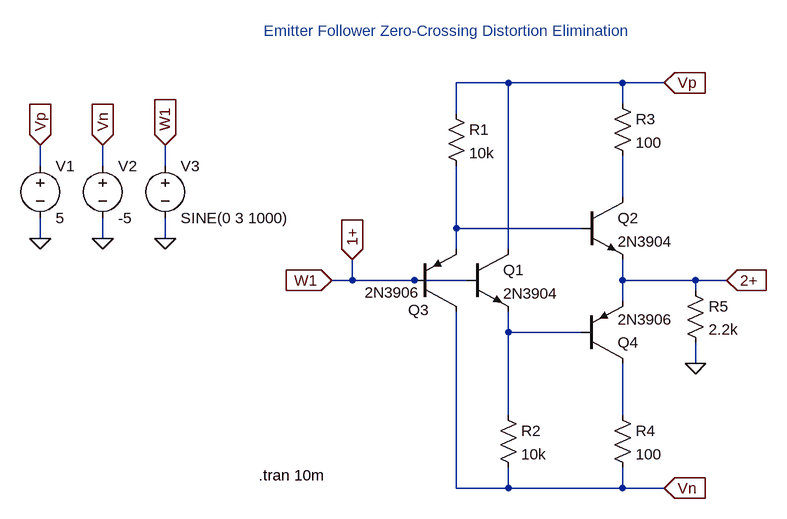
[diagram p0: schematic emit_ff_zero_crossing_elim_ltspice.asc]
emit_ff_zero_crossing_elim_ltspice.asc, the LTspice schematic file:
Version 4
SHEET 1 880 680
WIRE 128 -192 48 -192
WIRE 304 -192 128 -192
WIRE 368 -192 304 -192
WIRE 304 -160 304 -192
WIRE 48 -144 48 -192
WIRE -592 -64 -592 -96
WIRE -496 -64 -496 -96
WIRE -400 -64 -400 -96
WIRE 304 -16 304 -80
WIRE 48 32 48 -64
WIRE 240 32 48 32
WIRE -592 48 -592 16
WIRE -496 48 -496 16
WIRE -400 48 -400 16
WIRE 48 64 48 32
WIRE 128 64 128 -192
WIRE -112 112 -112 80
WIRE -112 112 -144 112
WIRE -16 112 -112 112
WIRE 64 112 -16 112
WIRE 304 112 304 80
WIRE 416 112 304 112
WIRE 464 112 416 112
WIRE 416 128 416 112
WIRE 304 144 304 112
WIRE 128 192 128 160
WIRE 240 192 128 192
WIRE 416 240 416 208
WIRE 128 320 128 192
WIRE 304 320 304 240
WIRE 48 432 48 160
WIRE 128 432 128 400
WIRE 128 432 48 432
WIRE 304 432 304 400
WIRE 304 432 128 432
WIRE 368 432 304 432
FLAG 416 240 0
FLAG 368 -192 Vp
IOPIN 368 -192 In
FLAG -112 80 1+
IOPIN -112 80 In
FLAG -144 112 W1
IOPIN -144 112 In
FLAG 464 112 2+
IOPIN 464 112 In
FLAG 368 432 Vn
IOPIN 368 432 In
FLAG -592 48 0
FLAG -496 48 0
FLAG -400 48 0
FLAG -592 -96 Vp
IOPIN -592 -96 In
FLAG -496 -96 Vn
IOPIN -496 -96 In
FLAG -400 -96 W1
IOPIN -400 -96 In
SYMBOL npn 64 64 R0
SYMATTR InstName Q1
SYMATTR Value 2N3904
SYMBOL npn 240 -16 R0
SYMATTR InstName Q2
SYMATTR Value 2N3904
SYMBOL pnp -16 160 M180
WINDOW 0 -10 2 Left 2
WINDOW 3 -77 29 Left 2
SYMATTR InstName Q3
SYMATTR Value 2N3906
SYMBOL pnp 240 240 M180
SYMATTR InstName Q4
SYMATTR Value 2N3906
SYMBOL res 32 -160 R0
SYMATTR InstName R1
SYMATTR Value 10k
SYMBOL res 112 304 R0
SYMATTR InstName R2
SYMATTR Value 10k
SYMBOL res 288 -176 R0
SYMATTR InstName R3
SYMATTR Value 100
SYMBOL res 288 304 R0
SYMATTR InstName R4
SYMATTR Value 100
SYMBOL res 400 112 R0
SYMATTR InstName R5
SYMATTR Value 2.2k
SYMBOL voltage -592 -80 R0
WINDOW 123 0 0 Left 0
WINDOW 39 0 0 Left 0
SYMATTR InstName V1
SYMATTR Value 5
SYMBOL voltage -496 -80 R0
WINDOW 123 0 0 Left 0
WINDOW 39 0 0 Left 0
SYMATTR InstName V2
SYMATTR Value -5
SYMBOL voltage -400 -80 R0
WINDOW 123 0 0 Left 0
WINDOW 39 0 0 Left 0
SYMATTR InstName V3
SYMATTR Value SINE(0 3 1000)
TEXT -248 -272 Left 2 ;Emitter Follower Zero-Crossing Distortion Elimination
TEXT -256 412 Left 2 !.tran 10m

The netlist it stands for:
* emit_ff_zero_crossing_elim_ltspice.asc
Q1 Vp W1 N003 0 2N3904
Q2 N001 N002 2+ 0 2N3904
Q3 Vn W1 N002 0 2N3906
Q4 N004 N003 2+ 0 2N3906
R1 Vp N002 10k
R2 N003 Vn 10k
R3 Vp N001 100
R4 N004 Vn 100
R5 2+ 0 2.2k
V1 Vp 0 5
V2 Vn 0 -5
V3 W1 0 SINE(0 3 1000)
.model NPN NPN
.model PNP PNP
.lib standard.bjt
* Emitter Follower Zero-Crossing Distortion Elimination
.tran 10m
.backanno
.end